# Altium schematic sheet comments.SchDoc
size A4; SheetNumber: 2; SheetTotal: 2
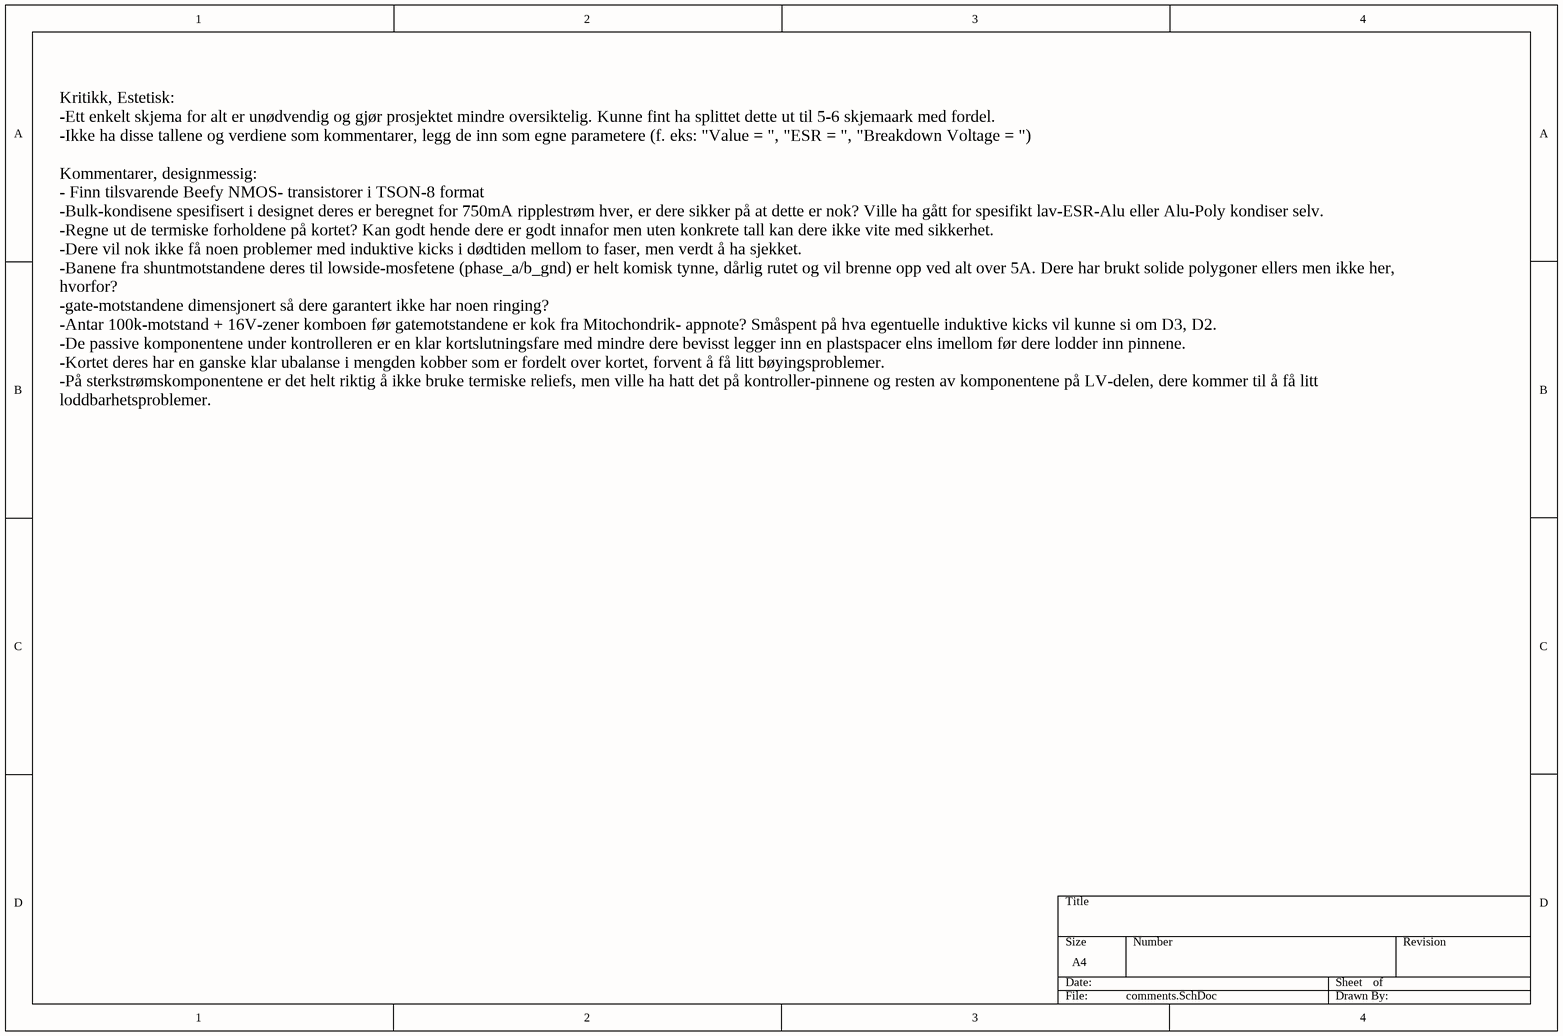
[diagram p0: comments.SchDoc]

## Notes on the sheet
- Kritikk, Estetisk:
  -Ett enkelt skjema for alt er unødvendig og gjør prosjektet mindre oversiktelig. Kunne fint ha splittet dette ut til 5-6 skjemaark med fordel.
  -Ikke ha disse tallene og verdiene som kommentarer, legg de inn som egne parametere (f. eks: "Value = ", "ESR = ", "Breakdown Voltage = ")
  Kommentarer, designmessig:
  - Finn tilsvarende Beefy NMOS- transistorer i TSON-8 format
  -Bulk-kondisene spesifisert i designet deres er beregnet for 750mA ripplestrøm hver, er dere sikker på at dette er nok? Ville ha gått for spesifikt lav-ESR-Alu eller Alu-Poly kondiser selv.
  -Regne ut de termiske forholdene på kortet? Kan godt hende dere er godt innafor men uten konkrete tall kan dere ikke vite med sikkerhet.
  -Dere vil nok ikke få noen problemer med induktive kicks i dødtiden mellom to faser, men verdt å ha sjekket.
  -Banene fra shuntmotstandene deres til lowside-mosfetene (phase_a/b_gnd) er helt komisk tynne, dårlig rutet og vil brenne opp ved alt over 5A. Dere har brukt solide polygoner ellers men ikke her, hvorfor?
  -gate-motstandene dimensjonert så dere garantert ikke har noen ringing?
  -Antar 100k-motstand + 16V-zener komboen før gatemotstandene er kok fra Mitochondrik- appnote? Småspent på hva egentuelle induktive kicks vil kunne si om D3, D2.
  -De passive komponentene under kontrolleren er en klar kortslutningsfare med mindre dere bevisst legger inn en plastspacer elns imellom før dere lodder inn pinnene.
  -Kortet deres har en ganske klar ubalanse i mengden kobber som er fordelt over kortet, forvent å få litt bøyingsproblemer.
  -På sterkstrømskomponentene er det helt riktig å ikke bruke termiske reliefs, men ville ha hatt det på kontroller-pinnene og resten av komponentene på LV-delen, dere kommer til å få litt loddbarhetsproblemer.